# Altium schematic sheet Top.SchDoc: SunS - General Block Diagram
size A2; Author: Grzegorz Gajoch; DocumentNumber: 10; SheetNumber: 10; SheetTotal: 16; Model: EM1; PageSetup: Record=PageOptions|CenterHorizontal=True|CenterVertical=True|PrintScale=0.73|XCorrection=1.00|YCorrection=1.00|PrintKind=1|BorderSize=5000000|LeftOffset=0|BottomOffset=0|Orientation=2|PaperLength=4200|PaperWidth=2970|Scale=100|PaperSource=15|PrintQuality=1200|MediaType=1|DitherType=10|PrintScaleMode=1|PaperKind=A3|PaperIndex=8; ResSerDig: 100
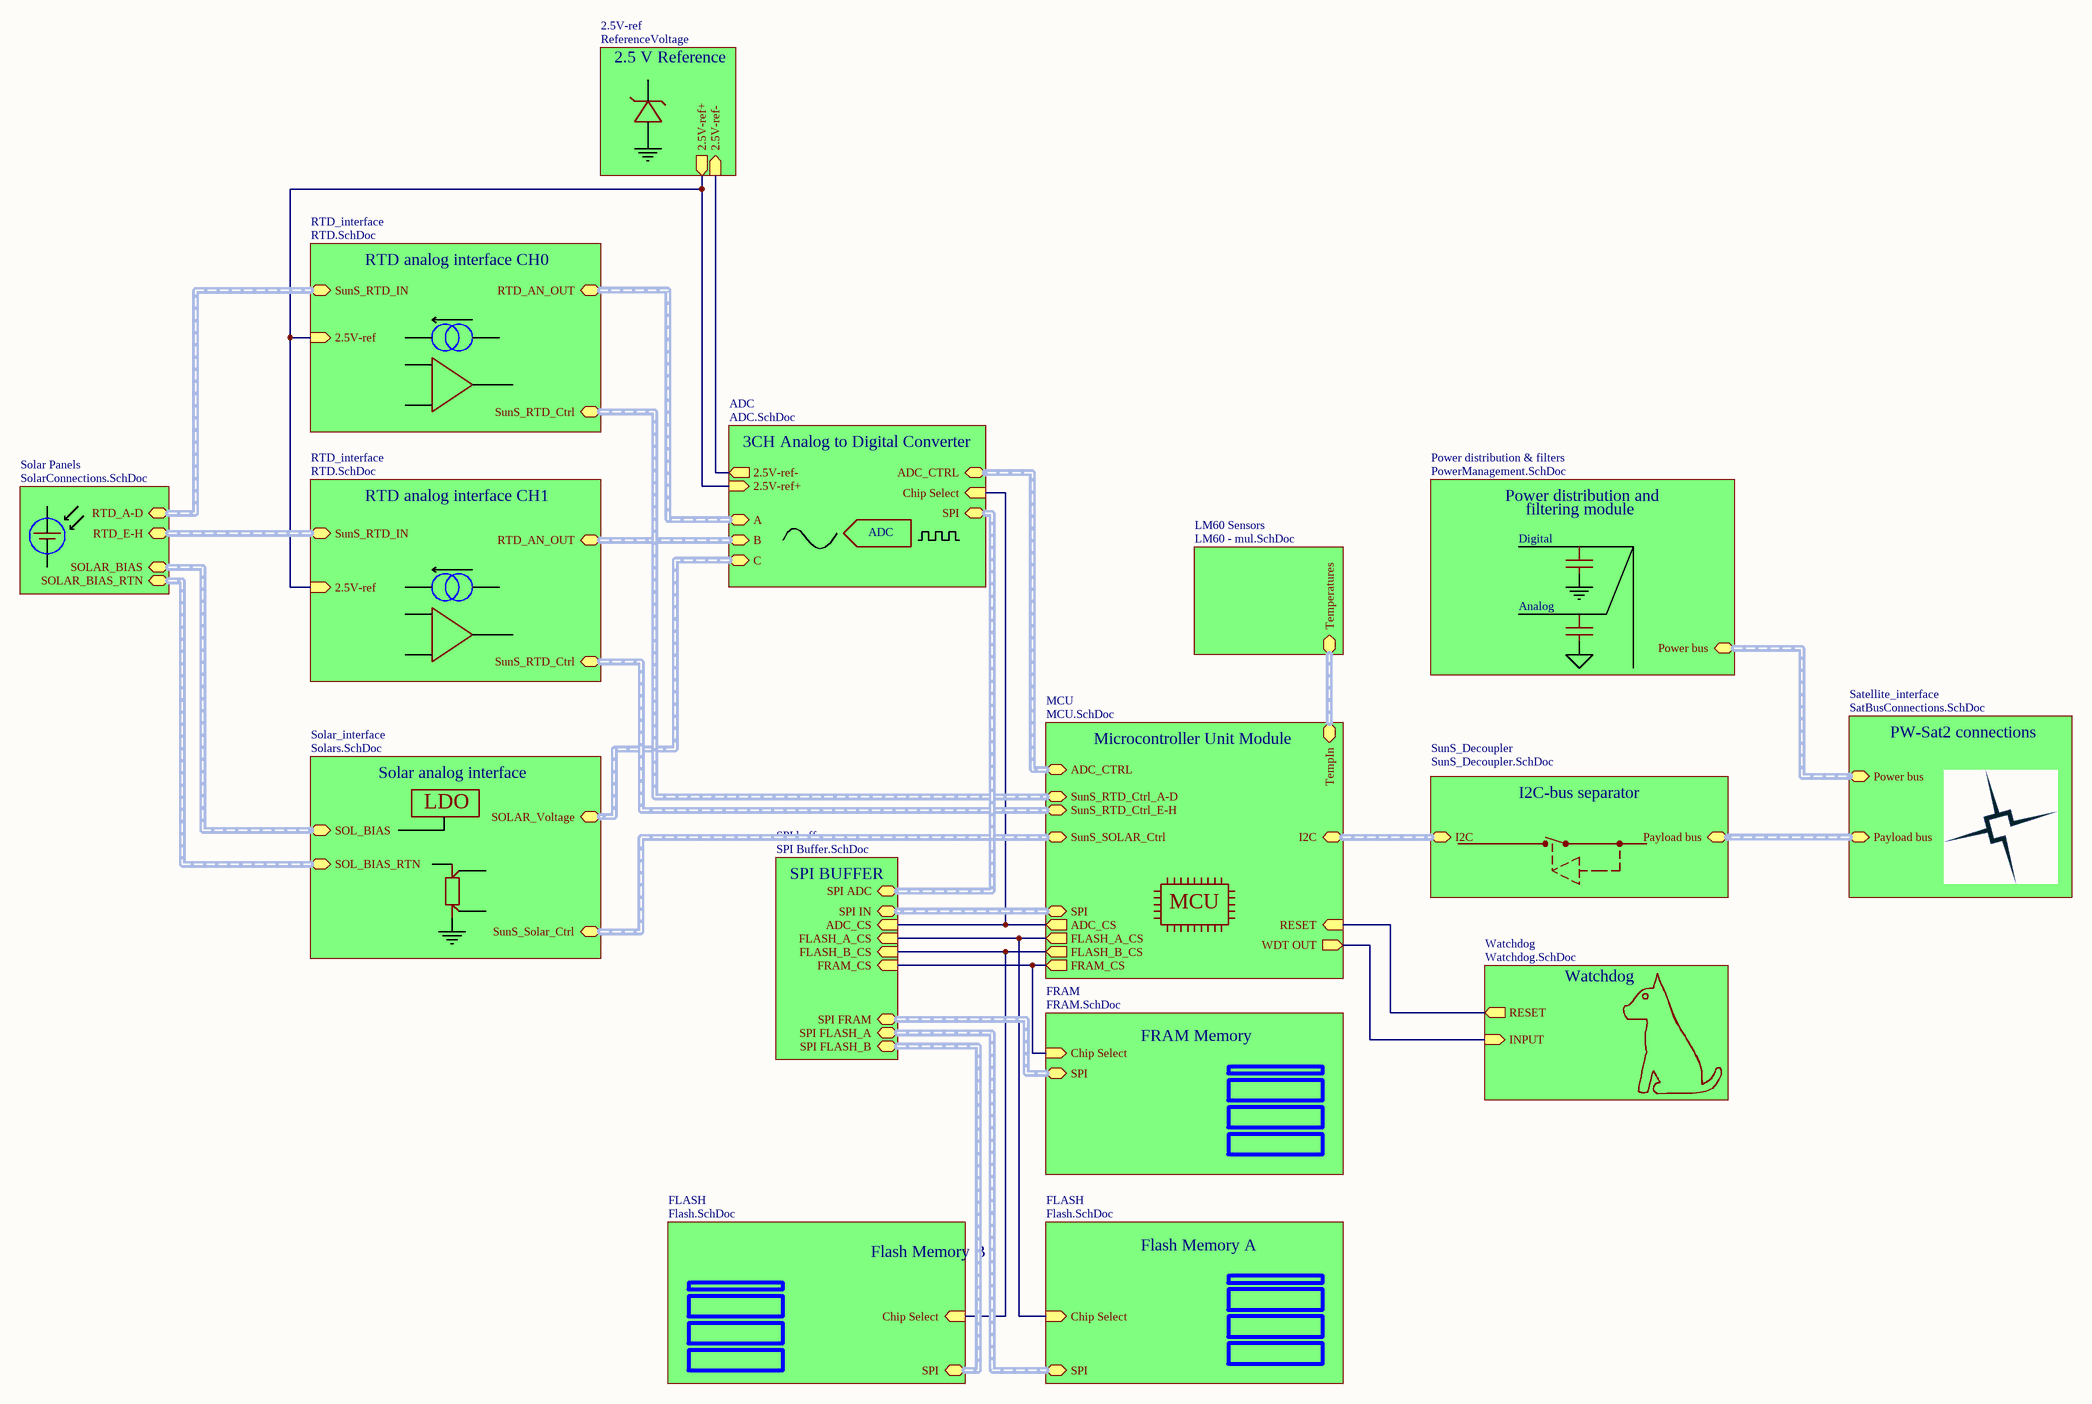
[diagram p0: Top.SchDoc]

## Sub-sheets
2.5V-ref = ReferenceVoltage: 2.5V-ref+ (out), 2.5V-ref- (in)
ADC = ADC.SchDoc: ADC_CTRL (harness ADC_DIG), 2.5V-ref+ (in), 2.5V-ref- (out), A (harness ADC_IN), B (harness ADC_IN), C (harness ADC_IN), Chip Select (in), SPI (harness SPI)
FLASH = Flash.SchDoc: SPI (harness SPI), Chip Select (in)
FLASH = Flash.SchDoc: SPI (harness SPI), Chip Select (in)
FRAM = FRAM.SchDoc: SPI (harness SPI), Chip Select (in)
LM60 Sensors = LM60 - mul.SchDoc: Temperatures (harness LM60)
MCU = MCU.SchDoc: SunS_RTD_Ctrl_A-D (harness MUX_Control), I2C (harness I2C), SunS_RTD_Ctrl_E-H (harness MUX_Control), ADC_CTRL (harness ADC_DIG), SPI (harness SPI), FRAM_CS (out), ADC_CS (out), FLASH_A_CS (out), FLASH_B_CS (out), RESET (in), WDT OUT (out), SunS_SOLAR_Ctrl (harness SunS_Solar_Ctrl), TempIn (harness LM60)
Power distribution & filters = PowerManagement.SchDoc: Power bus (harness Sat_Power)
RTD_interface = RTD.SchDoc: 2.5V-ref (in), SunS_RTD_Ctrl (harness MUX_Control), SunS_RTD_IN (harness SunS_RTD_Conn), RTD_AN_OUT (harness ADC_IN)
RTD_interface = RTD.SchDoc: 2.5V-ref (in), SunS_RTD_Ctrl (harness MUX_Control), SunS_RTD_IN (harness SunS_RTD_Conn), RTD_AN_OUT (harness ADC_IN)
Satellite_interface = SatBusConnections.SchDoc: Payload bus (harness Payload bus), Power bus (harness Sat_Power)
Solar Panels = SolarConnections.SchDoc: RTD_A-D, SOLAR_BIAS (harness Solar_Conn), RTD_E-H, SOLAR_BIAS_RTN (harness Solar_Conn)
Solar_interface = Solars.SchDoc: SOLAR_Voltage (harness ADC_IN), SOL_BIAS (harness Solar_Conn), SunS_Solar_Ctrl (harness SunS_Solar_Ctrl), SOL_BIAS_RTN (harness Solar_Conn)
SPI buffer = SPI Buffer.SchDoc: SPI IN (harness SPI), SPI FRAM (harness SPI), SPI FLASH_A (harness SPI), SPI FLASH_B (harness SPI), SPI ADC (harness SPI), FRAM_CS (in), FLASH_B_CS (in), FLASH_A_CS (in), ADC_CS (in)
SunS_Decoupler = SunS_Decoupler.SchDoc: Payload bus (harness Payload bus), I2C (harness I2C)
Watchdog = Watchdog.SchDoc: RESET (out), INPUT (in)

## Nets
(unnamed): sheet MCU/FRAM_CS, sheet FRAM/Chip Select, sheet SPI buffer/FRAM_CS
(unnamed): sheet MCU/ADC_CS, sheet ADC/Chip Select, sheet SPI buffer/ADC_CS
(unnamed): sheet MCU/FLASH_A_CS, sheet FLASH/Chip Select, sheet SPI buffer/FLASH_A_CS
(unnamed): sheet MCU/FLASH_B_CS, sheet FLASH/Chip Select, sheet SPI buffer/FLASH_B_CS
(unnamed): sheet MCU/RESET, sheet Watchdog/RESET
(unnamed): sheet MCU/WDT OUT, sheet Watchdog/INPUT
(unnamed): sheet RTD_interface/2.5V-ref, sheet 2.5V-ref/2.5V-ref+, sheet ADC/2.5V-ref+, sheet RTD_interface/2.5V-ref
(unnamed): sheet 2.5V-ref/2.5V-ref-, sheet ADC/2.5V-ref-

## Buses and harness runs
harness sheet ADC/A = sheet RTD_interface/RTD_AN_OUT
harness sheet ADC/ADC_CTRL = sheet MCU/ADC_CTRL
harness sheet ADC/B = sheet RTD_interface/RTD_AN_OUT
harness sheet ADC/C = sheet Solar_interface/SOLAR_Voltage
harness sheet ADC/SPI = sheet SPI buffer/SPI ADC
harness sheet FLASH/SPI = sheet SPI buffer/SPI FLASH_A
harness sheet FLASH/SPI = sheet SPI buffer/SPI FLASH_B
harness sheet FRAM/SPI = sheet SPI buffer/SPI FRAM
harness sheet LM60 Sensors/Temperatures = sheet MCU/TempIn
harness sheet MCU/I2C = sheet SunS_Decoupler/I2C
harness sheet MCU/SPI = sheet SPI buffer/SPI IN
harness sheet MCU/SunS_RTD_Ctrl_A-D = sheet RTD_interface/SunS_RTD_Ctrl
harness sheet MCU/SunS_RTD_Ctrl_E-H = sheet RTD_interface/SunS_RTD_Ctrl
harness sheet MCU/SunS_SOLAR_Ctrl = sheet Solar_interface/SunS_Solar_Ctrl
harness sheet Power distribution & filters/Power bus = sheet Satellite_interface/Power bus
harness sheet RTD_interface/SunS_RTD_IN = sheet Solar Panels/RTD_A-D
harness sheet RTD_interface/SunS_RTD_IN = sheet Solar Panels/RTD_E-H
harness sheet Satellite_interface/Payload bus = sheet SunS_Decoupler/Payload bus
harness sheet Solar Panels/SOLAR_BIAS = sheet Solar_interface/SOL_BIAS
harness sheet Solar Panels/SOLAR_BIAS_RTN = sheet Solar_interface/SOL_BIAS_RTN

## Notes on the sheet
- 2.5 V Reference
- RTD analog interface CH0
- 3CH Analog to Digital Converter
- RTD analog interface CH1
- ADC
- Power distribution and
- Digital
- filtering module
- Analog
- Microcontroller Unit Module
- PW-Sat2 connections
- Solar analog interface
- LDO
- I2C-bus separator
- SPI BUFFER
- MCU
- Watchdog
- FRAM Memory
- Flash Memory B
- Flash Memory A
- Title:
- Sheet:
- of
- Author:
- Model:
- File name:
- Document Number:
- Checked by:
- Iss-Rev:
- Approved by:
- Date: